# Altium schematic sheet Instrumental amplifier-1.SchDoc
size A; SheetNumber: 1; SheetTotal: 1
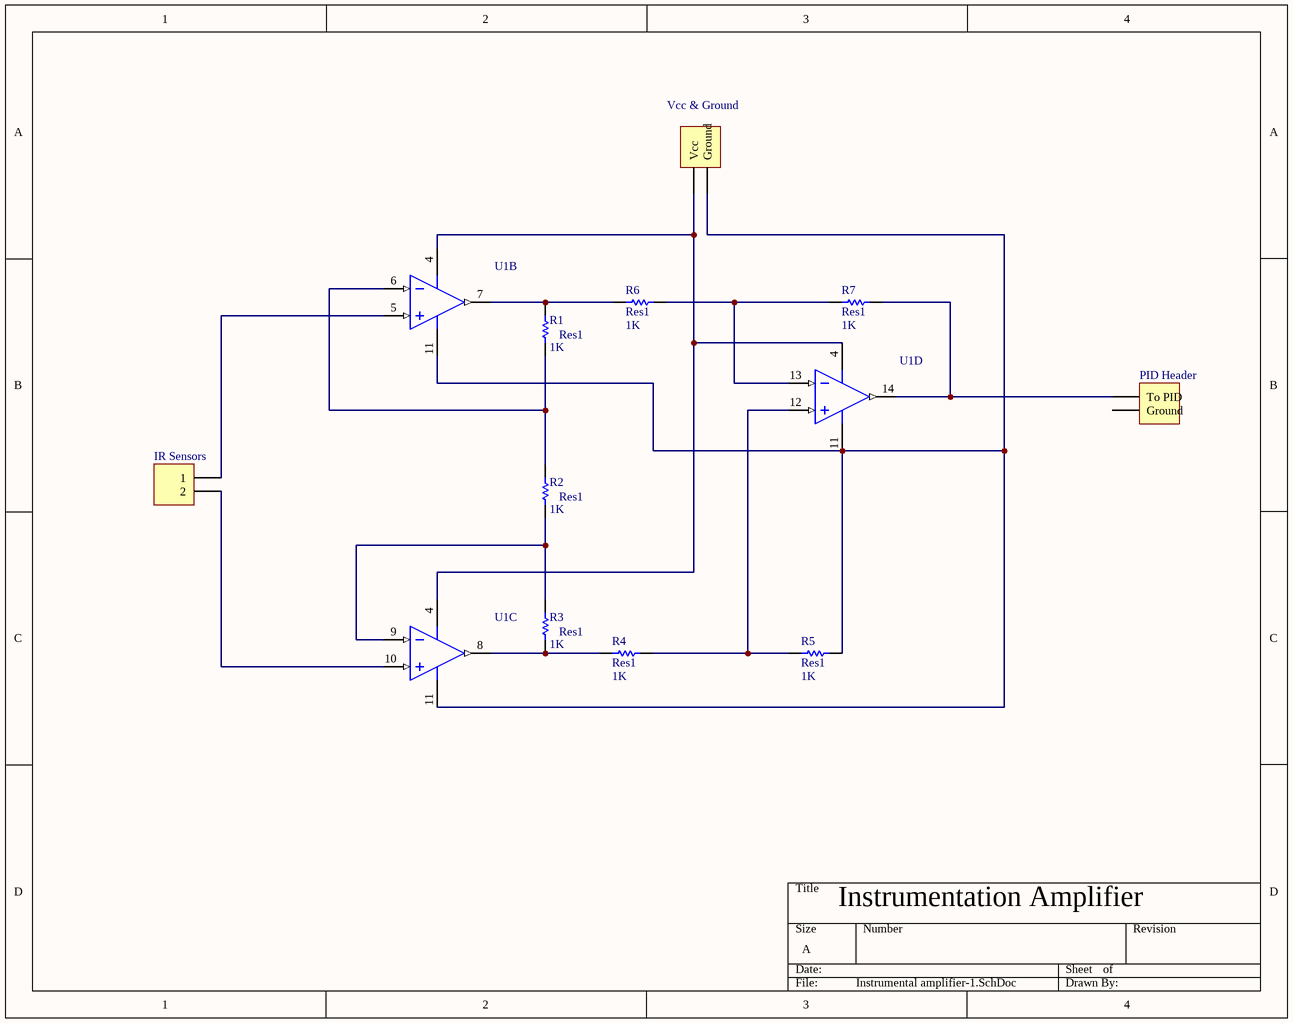
[diagram p0: Instrumental amplifier-1.SchDoc]

## Parts
IR_Sensors  Header 2  [HDR1X2]  (value not drawn)
PID_Header  Header 2  [HDR1X2]  (value not drawn)
R1  Res1  value 1K  [AXIAL-0.3]
R2  Res1  value 1K  [AXIAL-0.3]
R3  Res1  value 1K  [AXIAL-0.3]
R4  Res1  value 1K  [AXIAL-0.3]
R5  Res1  value 1K  [AXIAL-0.3]
R6  Res1  value 1K  [AXIAL-0.3]
R7  Res1  value 1K  [AXIAL-0.3]
U1  LM324N  [N0014A]  (value not drawn)  (parts B,C,D of 4)
Vcc_&_Ground  Header 2  [HDR1X2]  (value not drawn)

## Nets
NetIR_Sensors_1: IR_Sensors.1(2) U1.10(IN3+)
NetIR_Sensors_2: IR_Sensors.2(1) U1.5(IN2+)
NetPID_Header_1: PID_Header.1(To_PID) R7.2 U1.14(OUT4)
NetR1_1: R1.1 R2.2 U1.6(IN2-)
NetR1_2: R1.2 R6.1 U1.7(OUT2)
NetR2_1: R2.1 R3.2 U1.9(IN3-)
NetR3_1: R3.1 R4.1 U1.8(OUT3)
NetR4_2: R4.2 R5.1 U1.12(IN4+)
NetR5_2: R5.2 U1.11(GND) Vcc_&_Ground.2(Ground)
NetR6_2: R6.2 R7.1 U1.13(IN4-)
NetU1_4: U1.4(V+) Vcc_&_Ground.1(Vcc)

Not connected (* = marked no-connect by the designer): PID_Header 2(Ground)

## Notes on the sheet
- Instrumentation Amplifier

## Library data of the parts
IR_Sensors PID_Header Vcc_&_Ground = Header 2: Header, 2-Pin; LatestRevisionDate: 17-Jul-2002; LatestRevisionNote: Re-released for DXP Platform.; Publisher: Altium Limited
R1-R7 = Res1: Resistor; Published: 8-Jun-2000; LatestRevisionDate: 17-Jul-2002; LatestRevisionNote: Re-released for DXP Platform.; PackageReference: AXIAL-0.3; Publisher: Altium Limited; PackageDescription: Axial Device, Thru-Hole; 2 Leads; 0.3 in Pin Spacing
U1 = CMP-0055-00082-3: Low Power Quad Operational Amplifier, 14-pin MDIP; Manufacturer: Texas Instruments; CompType: Amplifiers; PowerWise: N; PackageTopMarking: NSUZXYYTTE#*LM324N; PackageDescription: MDIP, .750 x .250 x.130in, 14 Lead, .100in Pitch; Package Reference: N0014A; RoHS: N; Code_JEDEC: MS-001-AA; ComponentLink1URL: http://www.ti.com/general/docs/lit/getliterature.tsp?genericPartNumber=LM324&fileType=pdf; ComponentLink1Description: Datasheet URL; PinCount: 14